# Altium schematic sheet MCU.SchDoc
size A4
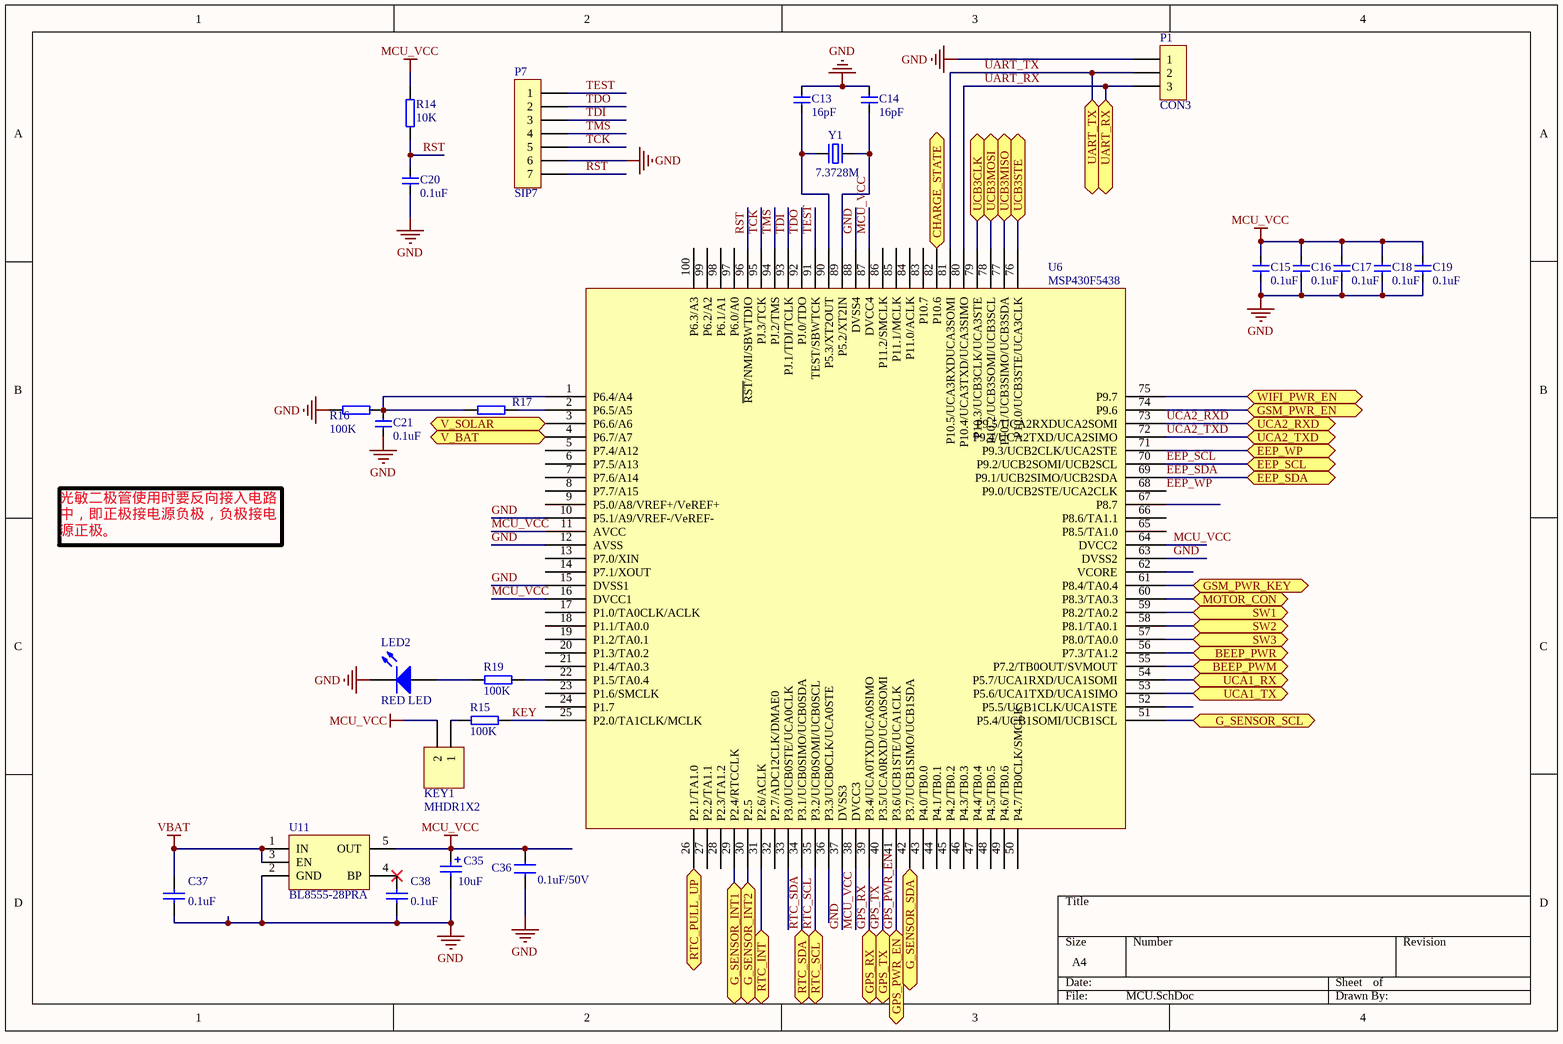
[diagram p0: MCU.SchDoc]

## Parts
C13  16pF  [0603C]
C14  16pF  [0603C]
C15  0.1uF  [0603C]
C16  0.1uF  [0603C]
C17  0.1uF  [0603C]
C18  0.1uF  [0603C]
C19  0.1uF  [0603C]
C20  0.1uF  [0603C]
C21  0.1uF  [0603C]
C35  10uF  [CAP1210]
C36  0.1uF/50V  [0603C]
C37  0.1uF  [0603C]
C38  0.1uF  [0603C]
KEY1  MHDR1X2  [MHDR1X2]
LED2  RED LED  [LED-0603]
P1  CON3  [HDR1X3]
P7  SIP7  [HDR1X7]
R14  10K  [0603R]
R15  100K  [0603R]
R16  100K  [0603R]
R17  200K  [0603R]
R19  100K  [0603R]
U6  MSP430F5438  [LQFP-100_14x14x05P]
U11  BL8555-28PRA  [SOT23-5]
Y1  7.3728M  [5032SMD]

## Ports
BEEP_PWM, BEEP_PWR, CHARGE_STATE, EEP_SCL, EEP_SDA, EEP_WP, G_SENSOR_INT1, G_SENSOR_INT2, G_SENSOR_SCL, G_SENSOR_SDA, GPS_PWR_EN, GPS_RX, GPS_TX, GSM_PWR_EN, GSM_PWR_KEY, MOTOR_CON, RTC_INT (bidir), RTC_PULL_UP, RTC_SCL, RTC_SDA, SW1, SW2, SW3, UART_RX, UART_TX, UCA1_RX, UCA1_TX, UCA2_RXD, UCA2_TXD, UCB3CLK, UCB3MISO, UCB3MOSI, UCB3STE, V_BAT, V_SOLAR, WIFI_PWR_EN

## Nets
GND: C13.1 C14.1 C15.1 C16.1 C17.1 C18.1 C19.1 C20.1 C21.2 C35.2 C36.2 C37.1 C38.1 LED2.2(K) P1.1 P7.6 R16.1 U6.10(P5.1/A9/VREF-/VeREF-) U6.12(AVSS) U6.15(DVSS1) U6.37(DVSS3) U6.63(DVSS2) U6.88(DVSS4) U11.2(GND)
MCU_VCC: C15.2 C16.2 C17.2 C18.2 C19.2 C35.1 C36.1 KEY1.2 R14.2 U6.11(AVCC) U6.16(DVCC1) U6.38(DVCC3) U6.64(DVCC2) U6.87(DVCC4) U11.5(OUT)
VBAT: C37.2 U11.1(IN) U11.3(EN)
BEEP_PWM: U6.55(P7.2/TB0OUT/SVMOUT) ; port BEEP_PWM
BEEP_PWR: U6.56(P7.3/TA1.2) ; port BEEP_PWR
CHARGE_STATE: U6.82(P10.6) ; port CHARGE_STATE
EEP_SCL: U6.70(P9.2/UCB2SOMI/UCB2SCL) ; port EEP_SCL
EEP_SDA: U6.69(P9.1/UCB2SIMO/UCB2SDA) ; port EEP_SDA
EEP_WP: U6.68(P9.0/UCB2STE/UCA2CLK)
EEP_WP: U6.71(P9.3/UCB2CLK/UCA2STE) ; port EEP_WP  [a separate net that carries the same name]
G_SENSOR_INT1: U6.29(P2.4/RTCCLK) ; port G_SENSOR_INT1
G_SENSOR_INT2: U6.30(P2.5) ; port G_SENSOR_INT2
G_SENSOR_SCL: U6.51(P5.4/UCB1SOMI/UCB1SCL) ; port G_SENSOR_SCL
G_SENSOR_SDA: U6.42(P3.7/UCB1SIMO/UCB1SDA) ; port G_SENSOR_SDA
GPS_PWR_EN: U6.41(P3.6/UCB1STE/UCA1CLK) ; port GPS_PWR_EN
GPS_RX: U6.39(P3.4/UCA0TXD/UCA0SIMO) ; port GPS_RX
GPS_TX: U6.40(P3.5/UCA0RXD/UCA0SOMI) ; port GPS_TX
GSM_PWR_EN: U6.74(P9.6) ; port GSM_PWR_EN
GSM_PWR_KEY: U6.61(P8.4/TA0.4) ; port GSM_PWR_KEY
KEY: R15.2 U6.25(P2.0/TA1CLK/MCLK)
MOTOR_CON: U6.60(P8.3/TA0.3) ; port MOTOR_CON
RST: C20.2 P7.7 R14.1 U6.96(~{RST}/NMI/SBWTDIO)
RTC_INT: U6.31(P2.6/ACLK) ; port RTC_INT
RTC_PULL_UP: U6.26(P2.1/TA1.0) ; port RTC_PULL_UP
RTC_SCL: U6.35(P3.2/UCB0SOMI/UCB0SCL) ; port RTC_SCL
RTC_SDA: U6.34(P3.1/UCB0SIMO/UCB0SDA) ; port RTC_SDA
SW1: U6.59(P8.2/TA0.2) ; port SW1
SW2: U6.58(P8.1/TA0.1) ; port SW2
SW3: U6.57(P8.0/TA0.0) ; port SW3
TCK: P7.5 U6.95(PJ.3/TCK)
TDI: P7.3 U6.93(PJ.1/TDI/TCLK)
TDO: P7.2 U6.92(PJ.0/TDO)
TEST: P7.1 U6.91(TEST/SBWTCK)
TMS: P7.4 U6.94(PJ.2/TMS)
UART_RX: P1.3 U6.80(P10.4/UCA3TXD/UCA3SIMO) ; port UART_RX
UART_TX: P1.2 U6.81(P10.5/UCA3RXDUCA3SOMI) ; port UART_TX
UCA1_RX: U6.54(P5.7/UCA1RXD/UCA1SOMI) ; port UCA1_RX
UCA1_TX: U6.53(P5.6/UCA1TXD/UCA1SIMO) ; port UCA1_TX
UCA2_RXD: U6.73(P9.5/UCA2RXDUCA2SOMI) ; port UCA2_RXD
UCA2_TXD: U6.72(P9.4/UCA2TXD/UCA2SIMO) ; port UCA2_TXD
UCB3CLK: U6.79(P10.3/UCB3CLK/UCA3STE) ; port UCB3CLK
UCB3MISO: U6.77(P10.1/UCB3SIMO/UCB3SDA) ; port UCB3MISO
UCB3MOSI: U6.78(P10.2/UCB3SOMI/UCB3SCL) ; port UCB3MOSI
UCB3STE: U6.76(P10.0/UCB3STE/UCA3CLK) ; port UCB3STE
V_BAT: U6.4(P6.7/A7) ; port V_BAT
V_SOLAR: U6.3(P6.6/A6) ; port V_SOLAR
WIFI_PWR_EN: U6.75(P9.7) ; port WIFI_PWR_EN
NetC13_2: C13.2 U6.90(P5.3/XT2OUT) Y1.1
NetC14_2: C14.2 U6.89(P5.2/XT2IN) Y1.2
NetC21_1: C21.1 R16.2 R17.1 U6.1(P6.4/A4)
NetC38_2: C38.2 U11.4(BP)
NetKEY1_1: KEY1.1 R15.1
NetLED2_1: LED2.1(A) R19.1
NetR17_2: R17.2 U6.2(P6.5/A5)
NetR19_2: R19.2 U6.22(P1.5/TA0.4)

Not connected (* = marked no-connect by the designer): U6 5(P7.4/A12) 6(P7.5/A13) 7(P7.6/A14) 8(P7.7/A15) 9(P5.0/A8/VREF+/VeREF+) 13(P7.0/XIN) 14(P7.1/XOUT) 17(P1.0/TA0CLK/ACLK) 18(P1.1/TA0.0) 19(P1.2/TA0.1) 20(P1.3/TA0.2) 21(P1.4/TA0.3) 23(P1.6/SMCLK) 24(P1.7) 27(P2.2/TA1.1) 28(P2.3/TA1.2) 32(P2.7/ADC12CLK/DMAE0) 33(P3.0/UCB0STE/UCA0CLK) 36(P3.3/UCB0CLK/UCA0STE) 43(P4.0/TB0.0) 44(P4.1/TB0.1) 45(P4.2/TB0.2) 46(P4.3/TB0.3) 47(P4.4/TB0.4) 48(P4.5/TB0.5) 49(P4.6/TB0.6) 50(P4.7/TB0CLK/SMCLK) 52(P5.5/UCB1CLK/UCA1STE) 62(VCORE) 65(P8.5/TA1.0) 66(P8.6/TA1.1) 67(P8.7) 83(P10.7) 84(P11.0/ACLK) 85(P11.1/MCLK) 86(P11.2/SMCLK) 97(P6.0/A0) 98(P6.1/A1) 99(P6.2/A2) 100(P6.3/A3)

## Notes on the sheet
- 光敏二极管使用时要反向接入电路中，即正极接电源负极，负极接电源正极。

## Library data of the parts
C13-C21 C36 = CAP
C35 = Cap Pol: Polarized Capacitor (Radial); Published: 8-Jun-2000; LatestRevisionDate: 17-Jul-2002; LatestRevisionNote: Re-released for DXP Platform.; Publisher: Altium Limited; Value: 10uF
C37 C38 = Cap: Capacitor; Value: 104; Published: 8-Jun-2000; LatestRevisionDate: 17-Jul-2002; LatestRevisionNote: Re-released for DXP Platform.; Publisher: Altium Limited
KEY1 = MHDR1X2: Header, 2-Pin; LatestRevisionDate: 17-Jul-2002; LatestRevisionNote: Re-released for DXP Platform.; Publisher: Altium Limited
LED2 = LED3: 红色LED; Published: 8-Jun-2000; LatestRevisionDate: 17-Dec-2003; LatestRevisionNote: PCB Footprint replaced.; DatasheetDocument: 16-Apr-2002; PackageDocument: 16-Apr-2002; PackageReference: 3.5X2.8X1.9; Publisher: Altium Limited
P1 = CON3: Connector
P7 = COM7
R14-R17 R19 = RES2A
U6 = MSP430F5438A
U11 = SGM2019
Y1 = CRYSTAL0.3: 5032 SMD 无源2pin